# Altium schematic sheet PMU.SchDoc
size A
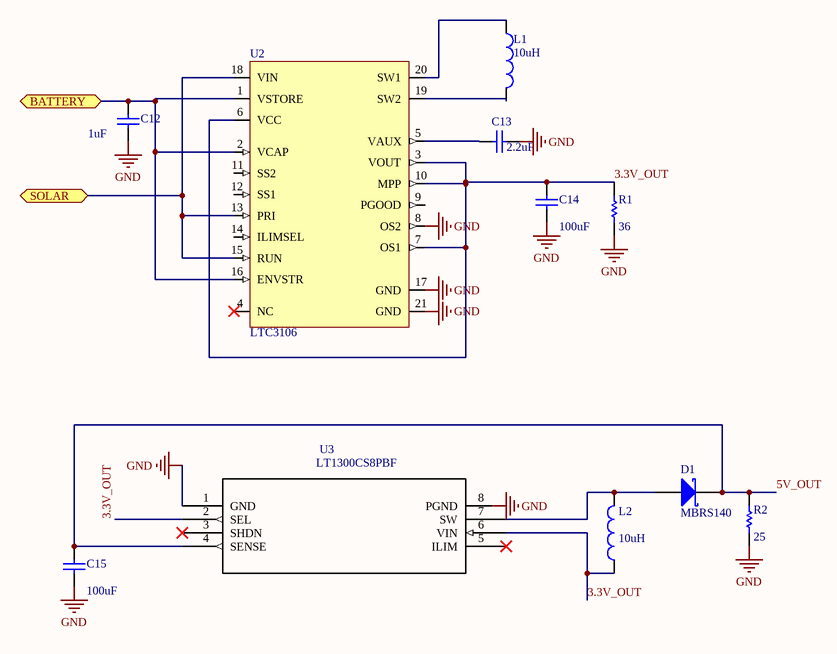
[diagram p0: PMU.SchDoc]

## Parts
C12  value 1uF  [RAD-0.3]  (hidden comment: Cap)
C13  value 2.2uF  [RAD-0.3]  (hidden comment: Cap)
C14  value 100uF  [RAD-0.3]  (hidden comment: Cap)
C15  value 100uF  [RAD-0.3]  (hidden comment: Cap)
D1  MBRS140  [TO-220AC]
L1  value 10uH  [0402-A]  (hidden comment: Inductor)
L2  value 10uH  [0402-A]  (hidden comment: Inductor)
R1  value 36  [AXIAL-0.3]  (hidden comment: Res1)
R2  value 25  [AXIAL-0.3]  (hidden comment: Res1)
U2  LTC3106  [LTC3106]
U3  LT1300CS8PBF  [SOIC-8_S]

## Ports
BATTERY, SOLAR

## Nets
GND: C12.1 C13.2 C14.1 C15.1 R1.1 R2.1 U2.8(OS2) U2.17(GND) U2.21(GND) U3.1(GND)
3.3V_OUT: C14.2 L2.1 R1.2 U2.3(VOUT) U2.6(VCC) U2.7(OS1) U2.10(MPP) U3.2(SEL) U3.6(VIN)
5V_OUT: C15.2 D1.1(K) R2.2 U3.4(SENSE)
BATTERY: C12.2 U2.1(VSTORE) U2.2(VCAP) U2.16(ENVSTR) ; port BATTERY
SOLAR: U2.13(PRI) U2.15(RUN) U2.18(VIN) ; port SOLAR
NetC13_1: C13.1 U2.5(VAUX)
NetD1_3: D1.3(A) L2.2 U3.7(SW)
NetL1_1: L1.1 U2.20(SW1)
NetL1_2: L1.2 U2.19(SW2)

Not connected (* = marked no-connect by the designer): U2 4(NC)* 9(PGOOD) 11(SS2) 12(SS1) 14(ILIMSEL); U3 3(SHDN)* 5(ILIM)* 8(PGND)

## Notes on the sheet
- Labels drawn without touching a wire or pin: GND

## Library data of the parts
C12-C15 = Cap: Capacitor; Published: 8-Jun-2000; LatestRevisionDate: 17-Jul-2002; LatestRevisionNote: Re-released for DXP Platform.; PackageReference: RAD-0.3; Publisher: Altium Limited; PackageDescription: Radial Cap, Thru-Hole; 2 Leads; 0.3 in Pin Spacing
D1 = Diode 10TQ040: Schottky Rectifier; Note: Terminal 2 is the TAB and is electrically connected to the cathode; Published: 8-Jun-2000; LatestRevisionDate: 17-Jul-2002; LatestRevisionNote: Re-released for DXP Platform.; DatasheetVersion: PD-2.057B; PackageVersion: Feb-1998; PackageReference: TO-220AC; Publisher: Altium Limited; PackageDescription: TO, Thru-Hole, Vertical, Heatsink Mounted; 3 In-Line Leads (1 Absent); Pitch 2.54 mm; ComponentLink1Description: Manufacturer Link; ComponentLink1URL: http://www.irf.com/
L1 L2 = Inductor: Code_IEC: 1005; Published: 8-Jun-2000; LatestRevisionDate: 29-May-2009; LatestRevisionNote: IPC-7351 Footprint Added.; PackageReference: 0402-A; Publisher: Altium Limited; PackageDescription: Chip Inductor; Code_JEITA: 0402
R1 R2 = Res1: Resistor; Published: 8-Jun-2000; LatestRevisionDate: 17-Jul-2002; LatestRevisionNote: Re-released for DXP Platform.; PackageReference: AXIAL-0.3; Publisher: Altium Limited; PackageDescription: Axial Device, Thru-Hole; 2 Leads; 0.3 in Pin Spacing
U3 = LT1300CS8PBF: PMIC - DC/DC voltage regulator Linear Technology LT1300CS8%23PBF Boost%2C Converter/amplifier SOIC 8; MP: LT1300CS8#PBF; Availability: Warning; Package: SO-8 Linear Technology; MF: Linear Technology; Price: 4.13 USD; Value: *